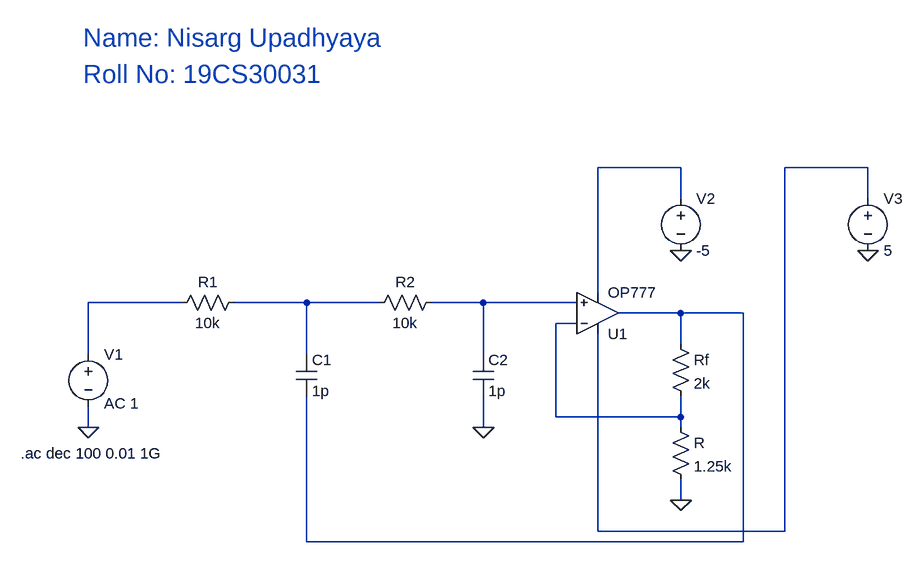
[diagram p0: schematic SNLABEXP4.asc]
SNLABEXP4.asc, the LTspice schematic file:
Version 4
SHEET 1 1368 680
WIRE 992 -144 864 -144
WIRE 1280 -144 1152 -144
WIRE 992 -96 992 -144
WIRE 1280 -96 1280 -144
WIRE 864 48 864 -144
WIRE 224 64 80 64
WIRE 416 64 304 64
WIRE 528 64 416 64
WIRE 688 64 608 64
WIRE 832 64 688 64
WIRE 992 80 896 80
WIRE 1088 80 992 80
WIRE 832 96 800 96
WIRE 992 128 992 80
WIRE 80 144 80 64
WIRE 416 144 416 64
WIRE 688 144 688 64
WIRE 800 240 800 96
WIRE 992 240 992 208
WIRE 992 240 800 240
WIRE 80 256 80 224
WIRE 688 256 688 208
WIRE 992 256 992 240
WIRE 992 368 992 336
WIRE 864 416 864 112
WIRE 1152 416 1152 -144
WIRE 1152 416 864 416
WIRE 416 432 416 208
WIRE 1088 432 1088 80
WIRE 1088 432 416 432
FLAG 80 256 0
FLAG 688 256 0
FLAG 992 368 0
FLAG 992 -16 0
FLAG 1280 -16 0
SYMBOL voltage 80 128 R0
WINDOW 123 24 91 Left 2
WINDOW 39 0 0 Left 0
SYMATTR Value2 AC 1
SYMATTR InstName V1
SYMATTR Value ""
SYMBOL OpAmps\\OP777 864 144 M180
SYMATTR InstName U1
SYMBOL res 320 48 R90
WINDOW 0 0 56 VBottom 2
WINDOW 3 32 56 VTop 2
SYMATTR InstName R1
SYMATTR Value 10k
SYMBOL res 624 48 R90
WINDOW 0 0 56 VBottom 2
WINDOW 3 32 56 VTop 2
SYMATTR InstName R2
SYMATTR Value 10k
SYMBOL cap 400 144 R0
SYMATTR InstName C1
SYMATTR Value 1p
SYMBOL cap 672 144 R0
SYMATTR InstName C2
SYMATTR Value 1p
SYMBOL res 976 112 R0
SYMATTR InstName Rf
SYMATTR Value 2k
SYMBOL res 976 240 R0
SYMATTR InstName R
SYMATTR Value 1.25k
SYMBOL voltage 992 -112 R0
WINDOW 123 0 0 Left 0
WINDOW 39 0 0 Left 0
SYMATTR InstName V2
SYMATTR Value -5
SYMBOL voltage 1280 -112 R0
WINDOW 123 0 0 Left 0
WINDOW 39 0 0 Left 0
SYMATTR InstName V3
SYMATTR Value 5
TEXT -24 296 Left 2 !.ac dec 100 0.01 1G
TEXT 72 -344 Left 4 ;Name: Nisarg Upadhyaya
TEXT 72 -288 Left 4 ;Roll No: 19CS30031

The netlist it stands for:
* SNLABEXP4.asc
V1 N003 0 AC 1
XU1 N005 N007 N002 N001 N006 OP777  ; pins In+ In- V+ V- OUT
R1 N004 N003 10k
R2 N005 N004 10k
C1 N004 N006 1p
C2 N005 0 1p
Rf N006 N007 2k
R N007 0 1.25k
V2 N001 0 -5
V3 N002 0 5
.ac dec 100 0.01 1G
* Name: Nisarg Upadhyaya
* Roll No: 19CS30031
.lib ADI.lib
.backanno
.end